# Altium project HOLYIOT NRF54H20.PrjPcb
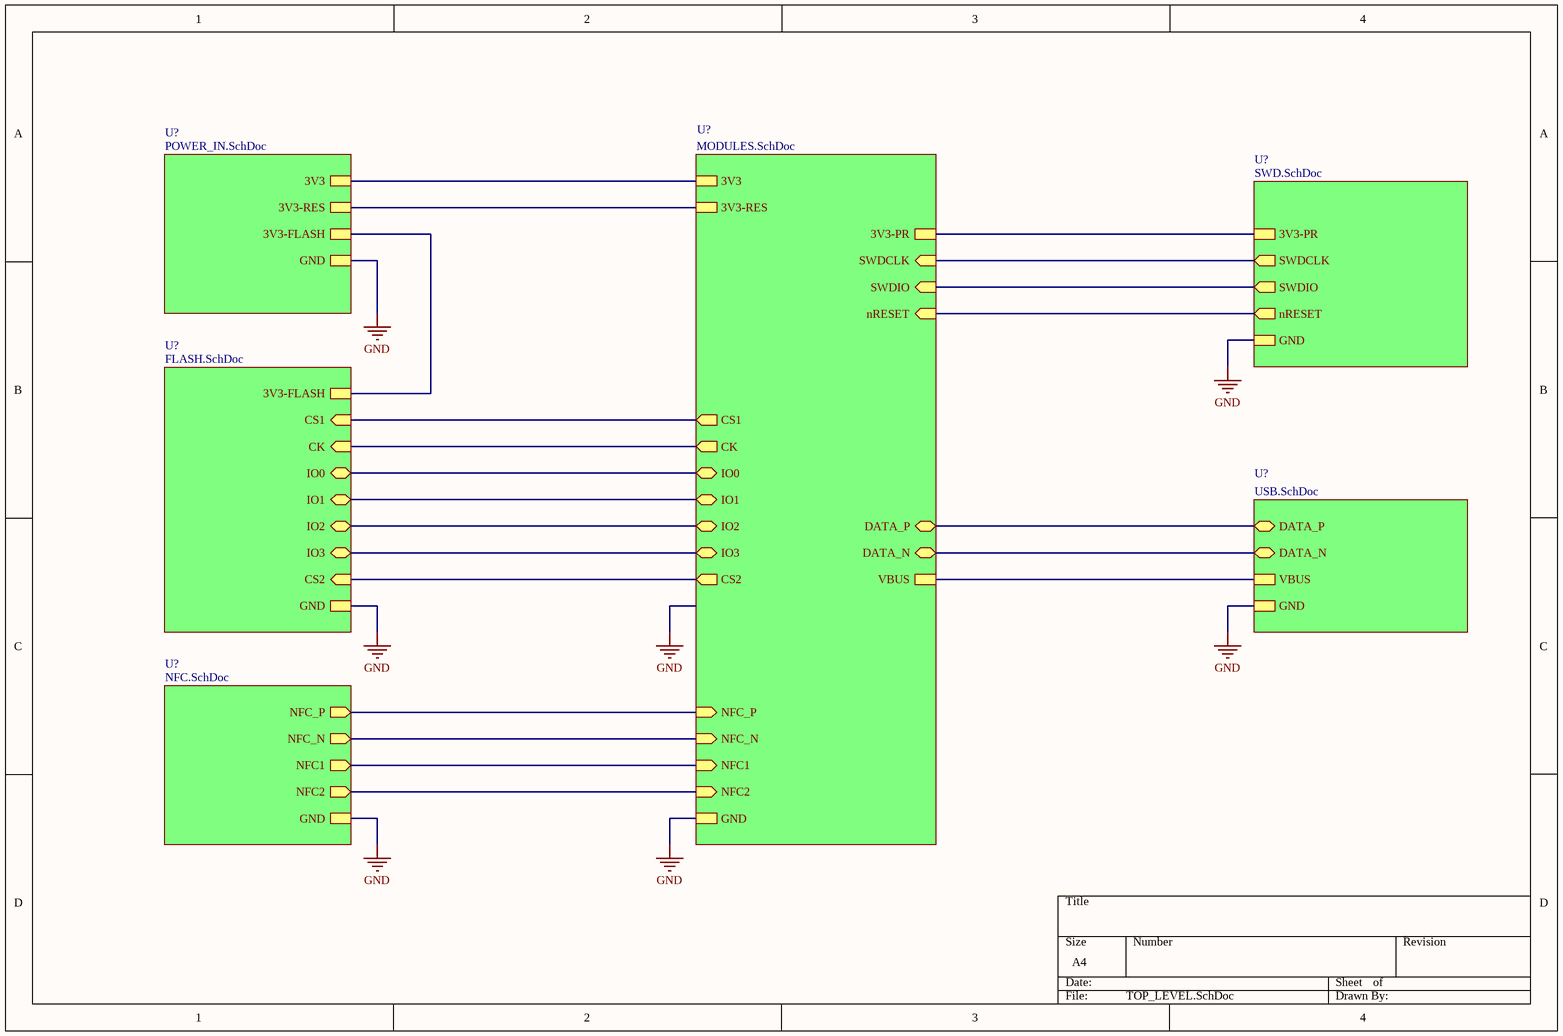
[diagram p0: TOP_LEVEL.SchDoc]
7 sheets, 101 parts. Net scope: strictly hierarchical (ports join the sheet entries above them; power ports are local).
Board file: PCB1.PcbDoc
Sheets:
  TOP_LEVEL.SchDoc
    U? = POWER_IN.SchDoc
    U? = MODULES.SchDoc
    U? = SWD.SchDoc
    U? = FLASH.SchDoc
    U? = USB.SchDoc
    U? = NFC.SchDoc

## Sheet TOP_LEVEL.SchDoc
size A4; SheetNumber: 1; SheetTotal: 7

### Sub-sheets
U? = POWER_IN.SchDoc: GND, 3V3, 3V3-RES, 3V3-FLASH
U? = MODULES.SchDoc: SWDCLK (in), SWDIO (in), nRESET (in), CS1 (out), CK (out), IO0 (bidir), IO1 (bidir), IO2 (bidir), NFC1 (in), NFC2 (in), NFC_N (in), NFC_P (in), GND, 3V3, 3V3-RES, 3V3-PR, VBUS, DATA_P (bidir), DATA_N (bidir), IO3 (bidir), CS2 (out)
U? = SWD.SchDoc: SWDCLK (out), SWDIO (out), nRESET (out), GND, 3V3-PR
U? = FLASH.SchDoc: CS1 (in), CK (in), IO0 (bidir), IO1 (bidir), IO2 (bidir), GND, 3V3-FLASH, IO3 (bidir), CS2 (in)
U? = USB.SchDoc: GND, VBUS, DATA_P (bidir), DATA_N (bidir)
U? = NFC.SchDoc: NFC_P (out), NFC_N (out), NFC1 (out), NFC2 (out), GND

### Nets
GND: sheet U?/GND, sheet U?/GND, sheet U?/GND, sheet U?/GND, sheet U?/GND, sheet U?/GND
DATA_N: sheet U?/DATA_N, sheet U?/DATA_N
DATA_P: sheet U?/DATA_P, sheet U?/DATA_P
IO0_APS: sheet U?/IO0, sheet U?/IO0
IO1_APS: sheet U?/IO1, sheet U?/IO1
IO2_APS: sheet U?/IO2, sheet U?/IO2
IO3_APS: sheet U?/IO3, sheet U?/IO3
nRESET: sheet U?/nRESET, sheet U?/nRESET
SWDCLK: sheet U?/SWDCLK, sheet U?/SWDCLK
SWDIO: sheet U?/SWDIO, sheet U?/SWDIO
VDD_APS: sheet U?/3V3, sheet U?/3V3-RES, sheet U?/3V3-FLASH, sheet U?/3V3, sheet U?/3V3-RES, sheet U?/3V3-PR, sheet U?/3V3-PR, sheet U?/3V3-FLASH
NetC7_2: sheet U?/NFC1, sheet U?/NFC1
NetC8_1: sheet U?/NFC2, sheet U?/NFC2
NetC9_2: sheet U?/NFC_P, sheet U?/NFC_P
NetC10_1: sheet U?/NFC_N, sheet U?/NFC_N
NetH20_7: sheet U?/CS2, sheet U?/CS2
NetH20_15: sheet U?/CK, sheet U?/CK
NetH20_18: sheet U?/CS1, sheet U?/CS1
NetH20_77: sheet U?/VBUS, sheet U?/VBUS

## Sheet POWER_IN.SchDoc
size A4; SheetNumber: 2; SheetTotal: 7
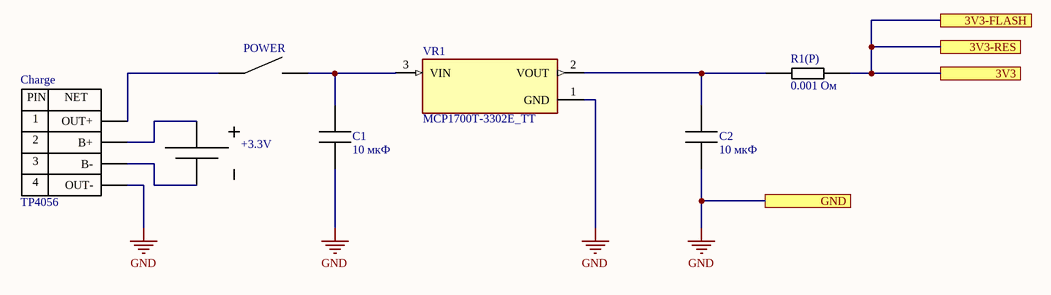
[diagram p1: POWER_IN.SchDoc]

### Parts
+3.3V  Battery  [Battery connect]  (value not drawn)
C1  10 мкФ  [Murata GRM21BR60J106K]
C2  10 мкФ  [Murata GRM21BR60J106K]
Charge  TP4056  [TP4056]
POWER  SMRS-101-1C2  [Button]  (value not drawn)
R1(P)  0.001 Ом  [Resistor 0.001]
VR1  MCP1700T-3302E_TT  [SOT95P237X112-3N]

### Ports
3V3 (see TOP_LEVEL[1A], MODULES[1C]), 3V3-FLASH (see TOP_LEVEL[1A], FLASH[3B]), 3V3-RES (see TOP_LEVEL[1A], MODULES[4A]), GND (see TOP_LEVEL[1A], FLASH[3C], MODULES[2D], NFC[2C], SWD[2B], USB[2C])

### Nets
GND: C1.1 C2.1 Charge.4(OUT-) VR1.1(GND) ; port GND
VDD_APS: R1(P).2 ; port 3V3, port 3V3-RES, port 3V3-FLASH
Net+3.3V_1: +3.3V.1 Charge.3(B-)
Net+3.3V_2: +3.3V.2 Charge.2(B+)
NetC1_2: C1.2 POWER.2 VR1.3(VIN)
NetC2_2: C2.2 R1(P).1 VR1.2(VOUT)
NetCharge_1: Charge.1(OUT+) POWER.1

### Notes on the sheet
- (in symbol TP4056) PIN; NET

### Library data of the parts
C1 C2 = Murata GRM21BR60J106K
POWER = Button
R1(P) = YAGEO PA2512FKF7W0R001E
VR1 = MCP1700T-3302E_TT: Pwr Sply Func,Voltage Regulator,LDO,SOT-23,PD 369.6mW,VO 3.3V,Regline +/-0.75%/V | Microchip Technology Inc. MCP1700T-3302E/TT; SnapEDA_Link: https://www.snapeda.com/parts/MCP1700T-3302E/TT/Microchip/view-part/?ref=snap; Package: SOT-23 Microchip; Value: *; MF: Microchip; MP: MCP1700T-3302E/TT; Check_prices: https://www.snapeda.com/parts/MCP1700T-3302E/TT/Microchip/view-part/?ref=eda

## Sheet MODULES.SchDoc
size A4; SheetNumber: 3; SheetTotal: 7
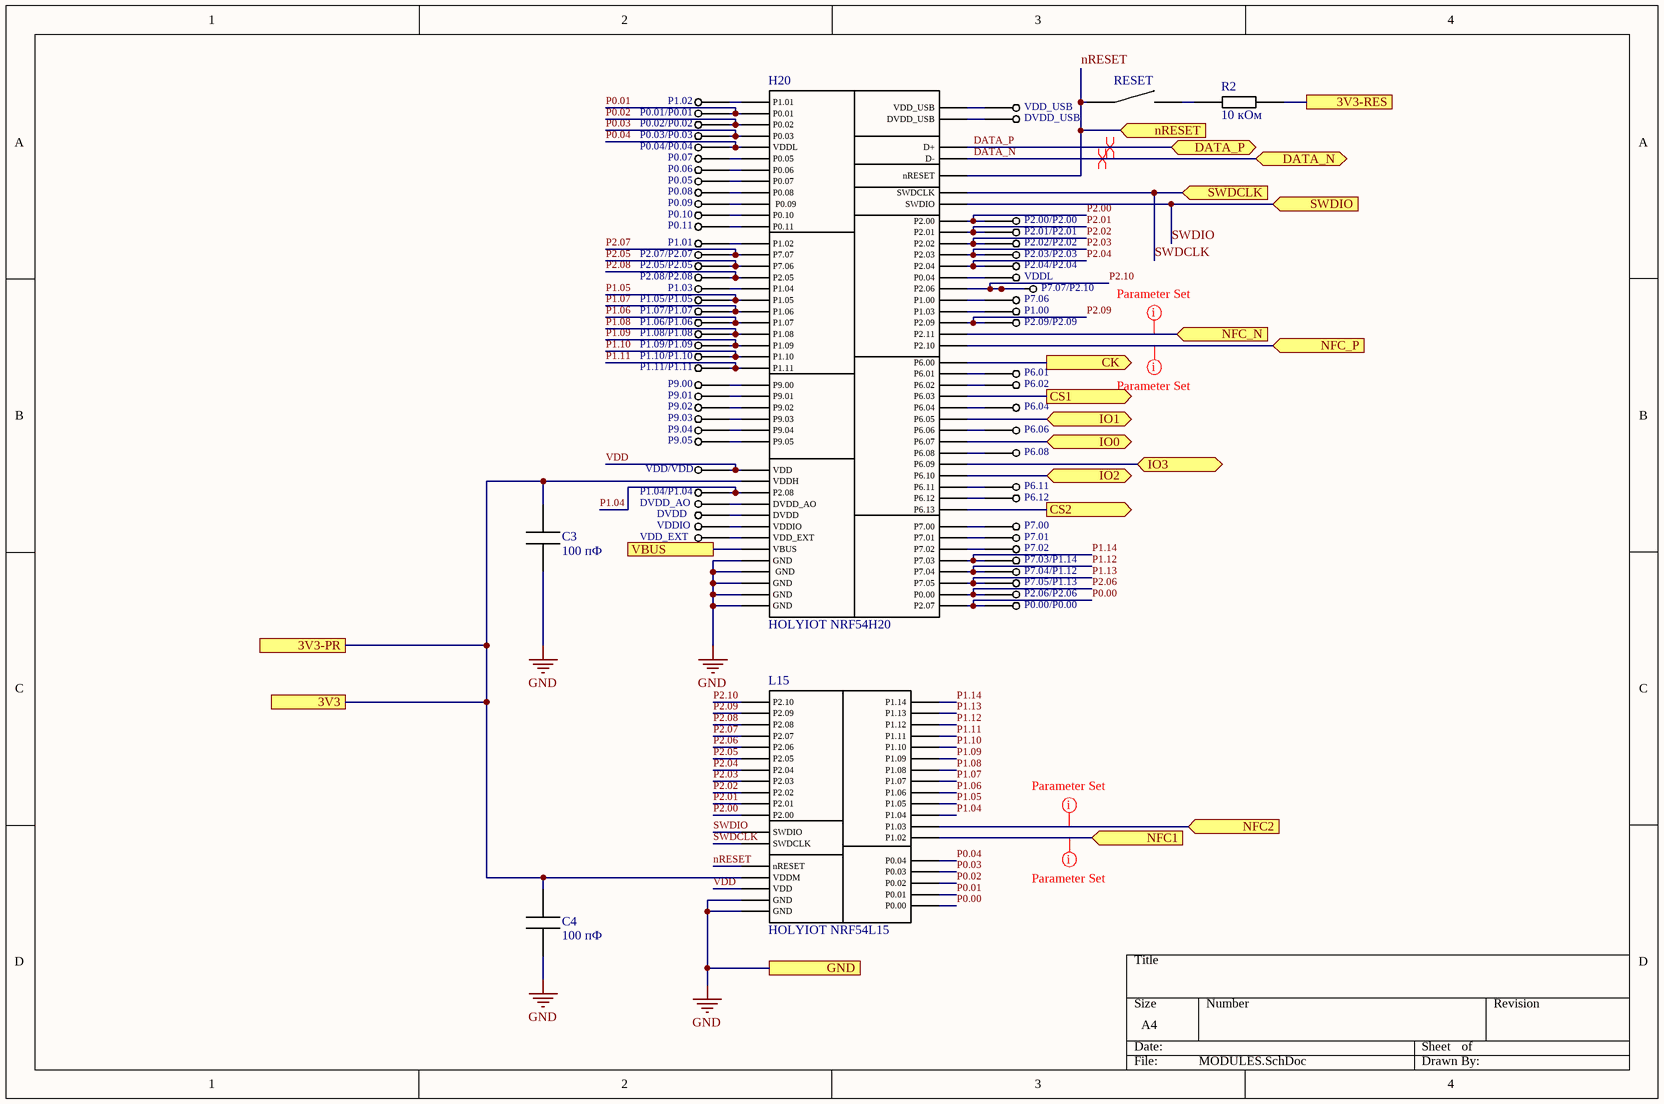
[diagram p2: MODULES.SchDoc]

### Parts
C3  100 пФ  [Murata GRM2165C1H101J]
C4  100 пФ  [Murata GRM2165C1H101J]
DVDD  PLS-1 (Ningbo Xinlaiya)  [PLS-1]  (value not drawn)
DVDD_AO  PLS-1 (Ningbo Xinlaiya)  [PLS-1]  (value not drawn)
DVDD_USB  PLS-1 (Ningbo Xinlaiya)  [PLS-1]  (value not drawn)
H20  HOLYIOT NRF54H20  [HOLYIOT NRF54H20]
L15  HOLYIOT NRF54L15  [HOLYIOT NRF54L15]
P0.00/P0.00  PLS-1 (Ningbo Xinlaiya)  [PLS-1]  (value not drawn)
P0.01/P0.01  PLS-1 (Ningbo Xinlaiya)  [PLS-1]  (value not drawn)
P0.02/P0.02  PLS-1 (Ningbo Xinlaiya)  [PLS-1]  (value not drawn)
P0.03/P0.03  PLS-1 (Ningbo Xinlaiya)  [PLS-1]  (value not drawn)
P0.04/P0.04  PLS-1 (Ningbo Xinlaiya)  [PLS-1]  (value not drawn)
P0.05  PLS-1 (Ningbo Xinlaiya)  [PLS-1]  (value not drawn)
P0.06  PLS-1 (Ningbo Xinlaiya)  [PLS-1]  (value not drawn)
P0.07  PLS-1 (Ningbo Xinlaiya)  [PLS-1]  (value not drawn)
P0.08  PLS-1 (Ningbo Xinlaiya)  [PLS-1]  (value not drawn)
P0.09  PLS-1 (Ningbo Xinlaiya)  [PLS-1]  (value not drawn)
P0.10  PLS-1 (Ningbo Xinlaiya)  [PLS-1]  (value not drawn)
P0.11  PLS-1 (Ningbo Xinlaiya)  [PLS-1]  (value not drawn)
P1.00  PLS-1 (Ningbo Xinlaiya)  [PLS-1]  (value not drawn)
P1.01  PLS-1 (Ningbo Xinlaiya)  [PLS-1]  (value not drawn)
P1.02  PLS-1 (Ningbo Xinlaiya)  [PLS-1]  (value not drawn)
P1.03  PLS-1 (Ningbo Xinlaiya)  [PLS-1]  (value not drawn)
P1.04/P1.04  PLS-1 (Ningbo Xinlaiya)  [PLS-1]  (value not drawn)
P1.05/P1.05  PLS-1 (Ningbo Xinlaiya)  [PLS-1]  (value not drawn)
P1.06/P1.06  PLS-1 (Ningbo Xinlaiya)  [PLS-1]  (value not drawn)
P1.07/P1.07  PLS-1 (Ningbo Xinlaiya)  [PLS-1]  (value not drawn)
P1.08/P1.08  PLS-1 (Ningbo Xinlaiya)  [PLS-1]  (value not drawn)
P1.09/P1.09  PLS-1 (Ningbo Xinlaiya)  [PLS-1]  (value not drawn)
P1.10/P1.10  PLS-1 (Ningbo Xinlaiya)  [PLS-1]  (value not drawn)
P1.11/P1.11  PLS-1 (Ningbo Xinlaiya)  [PLS-1]  (value not drawn)
P2.00/P2.00  PLS-1 (Ningbo Xinlaiya)  [PLS-1]  (value not drawn)
P2.01/P2.01  PLS-1 (Ningbo Xinlaiya)  [PLS-1]  (value not drawn)
P2.02/P2.02  PLS-1 (Ningbo Xinlaiya)  [PLS-1]  (value not drawn)
P2.03/P2.03  PLS-1 (Ningbo Xinlaiya)  [PLS-1]  (value not drawn)
P2.04/P2.04  PLS-1 (Ningbo Xinlaiya)  [PLS-1]  (value not drawn)
P2.05/P2.05  PLS-1 (Ningbo Xinlaiya)  [PLS-1]  (value not drawn)
P2.06/P2.06  PLS-1 (Ningbo Xinlaiya)  [PLS-1]  (value not drawn)
P2.07/P2.07  PLS-1 (Ningbo Xinlaiya)  [PLS-1]  (value not drawn)
P2.08/P2.08  PLS-1 (Ningbo Xinlaiya)  [PLS-1]  (value not drawn)
P2.09/P2.09  PLS-1 (Ningbo Xinlaiya)  [PLS-1]  (value not drawn)
P6.01  PLS-1 (Ningbo Xinlaiya)  [PLS-1]  (value not drawn)
P6.02  PLS-1 (Ningbo Xinlaiya)  [PLS-1]  (value not drawn)
P6.04  PLS-1 (Ningbo Xinlaiya)  [PLS-1]  (value not drawn)
P6.06  PLS-1 (Ningbo Xinlaiya)  [PLS-1]  (value not drawn)
P6.08  PLS-1 (Ningbo Xinlaiya)  [PLS-1]  (value not drawn)
P6.11  PLS-1 (Ningbo Xinlaiya)  [PLS-1]  (value not drawn)
P6.12  PLS-1 (Ningbo Xinlaiya)  [PLS-1]  (value not drawn)
P7.00  PLS-1 (Ningbo Xinlaiya)  [PLS-1]  (value not drawn)
P7.01  PLS-1 (Ningbo Xinlaiya)  [PLS-1]  (value not drawn)
P7.02  PLS-1 (Ningbo Xinlaiya)  [PLS-1]  (value not drawn)
P7.03/P1.14  PLS-1 (Ningbo Xinlaiya)  [PLS-1]  (value not drawn)
P7.04/P1.12  PLS-1 (Ningbo Xinlaiya)  [PLS-1]  (value not drawn)
P7.05/P1.13  PLS-1 (Ningbo Xinlaiya)  [PLS-1]  (value not drawn)
P7.06  PLS-1 (Ningbo Xinlaiya)  [PLS-1]  (value not drawn)
P7.07/P2.10  PLS-1 (Ningbo Xinlaiya)  [PLS-1]  (value not drawn)
P9.00  PLS-1 (Ningbo Xinlaiya)  [PLS-1]  (value not drawn)
P9.01  PLS-1 (Ningbo Xinlaiya)  [PLS-1]  (value not drawn)
P9.02  PLS-1 (Ningbo Xinlaiya)  [PLS-1]  (value not drawn)
P9.03  PLS-1 (Ningbo Xinlaiya)  [PLS-1]  (value not drawn)
P9.04  PLS-1 (Ningbo Xinlaiya)  [PLS-1]  (value not drawn)
P9.05  PLS-1 (Ningbo Xinlaiya)  [PLS-1]  (value not drawn)
R2  10 кОм  [Yageo RC0805JR-0710KL]
RESET  RES BUT  [RES BUT]  (value not drawn)
VDD/VDD  PLS-1 (Ningbo Xinlaiya)  [PLS-1]  (value not drawn)
VDD_EXT  PLS-1 (Ningbo Xinlaiya)  [PLS-1]  (value not drawn)
VDD_USB  PLS-1 (Ningbo Xinlaiya)  [PLS-1]  (value not drawn)
VDDIO  PLS-1 (Ningbo Xinlaiya)  [PLS-1]  (value not drawn)
VDDL  PLS-1 (Ningbo Xinlaiya)  [PLS-1]  (value not drawn)

### Ports
3V3 (see TOP_LEVEL[2A], POWER_IN[3B]), 3V3-PR (see TOP_LEVEL[3A], SWD[2B]), 3V3-RES (see TOP_LEVEL[2A], POWER_IN[3B]), CK (out, see TOP_LEVEL[2B], FLASH[1B]), CS1 (out, see TOP_LEVEL[2B], FLASH[1B]), CS2 (out, see TOP_LEVEL[2C], FLASH[2C]), DATA_N (bidir, see TOP_LEVEL[3C], USB[2B]), DATA_P (bidir, see TOP_LEVEL[3C], USB[2B]), GND (see TOP_LEVEL[2D], FLASH[3C], NFC[2C], POWER_IN[3C], SWD[2B], USB[2C]), IO0 (bidir, see TOP_LEVEL[2B], FLASH[1B]), IO1 (bidir, see TOP_LEVEL[2B], FLASH[1B]), IO2 (bidir, see TOP_LEVEL[2C], FLASH[1C]), IO3 (bidir, see TOP_LEVEL[2C], FLASH[1C]), NFC1 (in, see TOP_LEVEL[2C], NFC[1B]), NFC2 (in, see TOP_LEVEL[2D], NFC[1C]), NFC_N (in, see TOP_LEVEL[2C], NFC[1A]), NFC_P (in, see TOP_LEVEL[2C], NFC[1A]), nRESET (in, see TOP_LEVEL[3B], SWD[2B]), SWDCLK (in, see TOP_LEVEL[3A], SWD[2B]), SWDIO (in, see TOP_LEVEL[3B], SWD[2B]), VBUS (see TOP_LEVEL[3C], USB[2B])

### Nets
GND: C3.1 C4.1 H20.1(GND) H20.4(GND) H20.28(GND) H20.29(GND) H20.58(GND) L15.1(GND) L15.36(GND) ; port GND
DATA_N: H20.78(D-) ; port DATA_N
DATA_P: H20.79(D+) ; port DATA_P
IO0_APS: H20.13(P6.07) ; port IO0
IO1_APS: H20.20(P6.05) ; port IO1
IO2_APS: H20.10(P6.10) ; port IO2
IO3_APS: H20.11(P6.09) ; port IO3
nRESET: H20.72(nRESET) L15.35(nRESET) RESET.1 ; port nRESET
P0.00: H20.32(P2.07) L15.28(P0.00) P0.00/P0.00.1
P0.01: H20.68(P0.01) L15.29(P0.01) P0.01/P0.01.1
P0.02: H20.67(P0.02) L15.32(P0.02) P0.02/P0.02.1
P0.03: H20.66(P0.03) L15.33(P0.03) P0.03/P0.03.1
P0.04: H20.55(VDDL) L15.34(P0.04) P0.04/P0.04.1
P1.04: H20.31(P2.08) L15.12(P1.04) P1.04/P1.04.1
P1.05: H20.84(P1.05) L15.13(P1.05) P1.05/P1.05.1
P1.06: H20.60(P1.07) L15.14(P1.06) P1.06/P1.06.1
P1.07: H20.59(P1.06) L15.15(P1.07) P1.07/P1.07.1
P1.08: H20.83(P1.08) L15.16(P1.08) P1.08/P1.08.1
P1.09: H20.61(P1.09) L15.2(P1.09) P1.09/P1.09.1
P1.10: H20.81(P1.10) L15.3(P1.10) P1.10/P1.10.1
P1.11: H20.82(P1.11) L15.5(P1.11) P1.11/P1.11.1
P1.12: H20.38(P7.04) L15.6(P1.12) P7.04/P1.12.1
P1.13: H20.37(P7.05) L15.7(P1.13) P7.05/P1.13.1
P1.14: H20.39(P7.03) L15.8(P1.14) P7.03/P1.14.1
P2.00: H20.21(P2.00) L15.17(P2.00) P2.00/P2.00.1
P2.01: H20.22(P2.01) L15.18(P2.01) P2.01/P2.01.1
P2.02: H20.23(P2.02) L15.19(P2.02) P2.02/P2.02.1
P2.03: H20.24(P2.03) L15.20(P2.03) P2.03/P2.03.1
P2.04: H20.25(P2.04) L15.21(P2.04) P2.04/P2.04.1
P2.05: H20.36(P7.06) L15.22(P2.05) P2.05/P2.05.1
P2.06: H20.50(P0.00) L15.23(P2.06) P2.06/P2.06.1
P2.07: H20.35(P7.07) L15.24(P2.07) P2.07/P2.07.1
P2.08: H20.34(P2.05) L15.25(P2.08) P2.08/P2.08.1
P2.09: H20.30(P2.09) L15.26(P2.09) P2.09/P2.09.1
P2.10: H20.33(P2.06) L15.27(P2.10) P7.07/P2.10.1
SWDCLK: H20.74(SWDCLK) L15.30(SWDCLK) ; port SWDCLK
SWDIO: H20.73(SWDIO) L15.31(SWDIO) ; port SWDIO
VDD: H20.3(VDD) L15.4(VDD) VDD/VDD.1
VDD_APS: C3.2 C4.2 H20.2(VDDH) L15.9(VDDM) R2.2 ; port 3V3, port 3V3-PR, port 3V3-RES
NetC7_2: L15.10(P1.02) ; port NFC1
NetC8_1: L15.11(P1.03) ; port NFC2
NetC9_2: H20.27(P2.10) ; port NFC_P
NetC10_1: H20.26(P2.11) ; port NFC_N
NetDVDD_1: DVDD.1 H20.5(DVDD)
NetDVDD_AO_1: DVDD_AO.1 H20.6(DVDD_AO)
NetDVDD_USB_1: DVDD_USB.1 H20.76(DVDD_USB)
NetH20_7: H20.7(P6.13) ; port CS2
NetH20_8: H20.8(P6.12) P6.12.1
NetH20_9: H20.9(P6.11) P6.11.1
NetH20_12: H20.12(P6.08) P6.08.1
NetH20_14: H20.14(P6.06) P6.06.1
NetH20_15: H20.15(P6.00) ; port CK
NetH20_16: H20.16(P6.01) P6.01.1
NetH20_17: H20.17(P6.02) P6.02.1
NetH20_18: H20.18(P6.03) ; port CS1
NetH20_19: H20.19(P6.04) P6.04.1
NetH20_40: H20.40(P7.02) P7.02.1
NetH20_41: H20.41(P7.01) P7.01.1
NetH20_42: H20.42(P7.00) P7.00.1
NetH20_43: H20.43(P0.09) P0.09.1
NetH20_44: H20.44(P0.08) P0.08.1
NetH20_45: H20.45(P0.05) P0.07.1
NetH20_46: H20.46(P0.06) P0.06.1
NetH20_47: H20.47(P0.07) P0.05.1
NetH20_48: H20.48(P9.00) P9.00.1
NetH20_49: H20.49(P9.01) P9.01.1
NetH20_51: H20.51(P0.04) VDDL.1
NetH20_52: H20.52(P1.04) P1.03.1
NetH20_53: H20.53(P1.03) P1.00.1
NetH20_54: H20.54(P1.02) P1.01.1
NetH20_56: H20.56(P1.01) P1.02.1
NetH20_57: H20.57(P1.00) P7.06.1
NetH20_62: H20.62(P9.05) P9.05.1
NetH20_63: H20.63(P9.04) P9.04.1
NetH20_64: H20.64(P9.03) P9.03.1
NetH20_65: H20.65(P9.02) P9.02.1
NetH20_69: H20.69(P0.10) P0.10.1
NetH20_70: H20.70(P0.11) P0.11.1
NetH20_71: H20.71(VDDIO) VDDIO.1
NetH20_75: H20.75(VDD_EXT) VDD_EXT.1
NetH20_77: H20.77(VBUS) ; port VBUS
NetH20_80: H20.80(VDD_USB) VDD_USB.1
NetR2_1: R2.1 RESET.2

### Layout directives
differential pair; differential pair class USB: DATA_N, DATA_P
Parameter 1: 50 Ом: NetC7_2, NetC8_1, NetC9_2, NetC10_1

### Library data of the parts
C3 C4 = Murata GRM2165C1H101J
R2 = Yageo RC0805JR-0710KL

## Sheet SWD.SchDoc
size A4; SheetNumber: 4; SheetTotal: 7
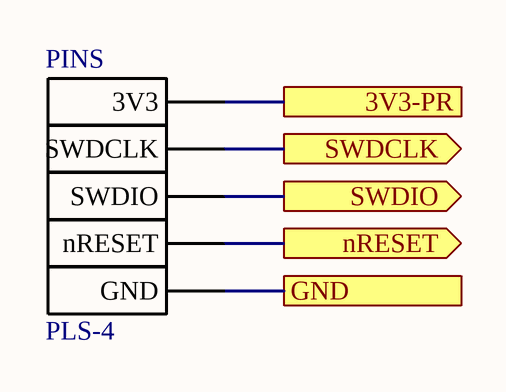
[diagram p3: SWD.SchDoc]

### Parts
PINS  PLS-4  [PLS-4 (DS-1021-1x4)]

### Ports
3V3-PR (see TOP_LEVEL[4A], MODULES[1C]), GND (see TOP_LEVEL[4B], FLASH[3C], MODULES[2D], NFC[2C], POWER_IN[3C], USB[3B]), nRESET (out, see TOP_LEVEL[4B], MODULES[3A]), SWDCLK (out, see TOP_LEVEL[4A], MODULES[3A]), SWDIO (out, see TOP_LEVEL[4B], MODULES[3A])

### Nets
GND: PINS.5(GND) ; port GND
nRESET: PINS.4(nRESET) ; port nRESET
SWDCLK: PINS.2(SWDCLK) ; port SWDCLK
SWDIO: PINS.3(SWDIO) ; port SWDIO
VDD_APS: PINS.1(3V3) ; port 3V3-PR

### Library data of the parts
PINS = PLS-4 (DS-1021-1x4)

## Sheet FLASH.SchDoc
size A4; SheetNumber: 5; SheetTotal: 7
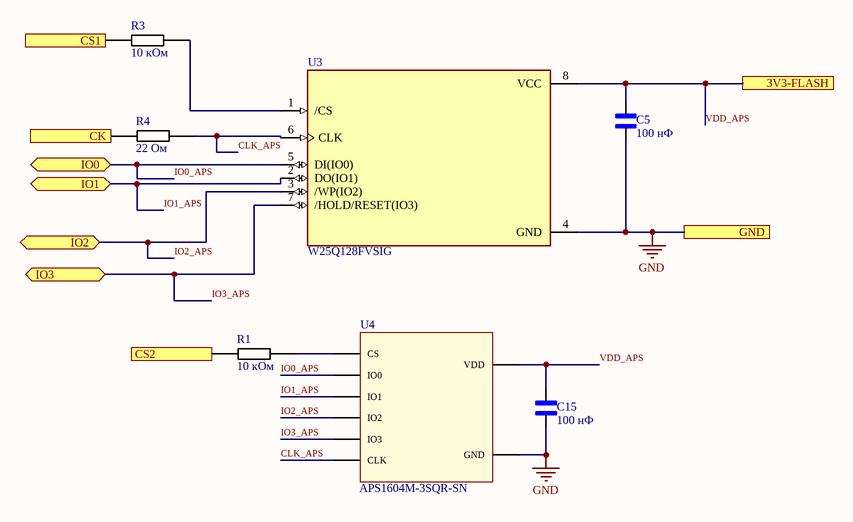
[diagram p4: FLASH.SchDoc]

### Parts
C5  100 нФ  [CAPC1005X22N]
C15  100 нФ  [CAPC1005X22N]
R1  10 кОм  [Yageo RC0805JR-0710KL]
R3  10 кОм  [Yageo RC0805JR-0710KL]
R4  22 Ом  [CR0805-JW-220ELF]
U3  W25Q128FVSIG  [SOIC127P790X216-8N]
U4  APS1604M-3SQR-SN  [APS1604M (SOP-8)]

### Ports
3V3-FLASH (see TOP_LEVEL[1B], POWER_IN[3B]), CK (in, see TOP_LEVEL[1B], MODULES[3B]), CS1 (in, see TOP_LEVEL[1B], MODULES[3B]), CS2 (in, see TOP_LEVEL[1C], MODULES[3B]), GND (see TOP_LEVEL[1C], MODULES[2D], NFC[2C], POWER_IN[3C], SWD[2B], USB[3B]), IO0 (bidir, see TOP_LEVEL[1B], MODULES[3B]), IO1 (bidir, see TOP_LEVEL[1B], MODULES[3B]), IO2 (bidir, see TOP_LEVEL[1C], MODULES[3B]), IO3 (bidir, see TOP_LEVEL[1C], MODULES[3B])

### Nets
GND: C5.1 C15.1 U3.4(GND) U4.4(GND) ; port GND
CLK_APS: R4.2 U3.6(CLK) U4.6(CLK)
IO0_APS: U3.5(DI(IO0)) U4.5(IO0) ; port IO0
IO1_APS: U3.2(DO(IO1)) U4.2(IO1) ; port IO1
IO2_APS: U3.3(/WP(IO2)) U4.3(IO2) ; port IO2
IO3_APS: U3.7(/HOLD/RESET(IO3)) U4.7(IO3) ; port IO3
VDD_APS: C5.2 C15.2 U3.8(VCC) U4.8(VDD) ; port 3V3-FLASH
NetH20_7: R1.1 ; port CS2
NetH20_15: R4.1 ; port CK
NetH20_18: R3.1 ; port CS1
NetR1_2: R1.2 U4.1(CS)
NetR3_2: R3.2 U3.1(/CS)

### Library data of the parts
C5 C15 = GRM152R60J104KE19D: SMD Capacitor X5R(EIA) with Capacitance: 0.10uF Tol. 10%. Rated Voltage: 6.3Vdc; MF: Murata; SnapEDA_Link: https://www.snapeda.com/parts/GRM152R60J104KE19D/Murata/view-part/?ref=snap; Package: 1005 Murata; Value: *; MP: GRM152R60J104KE19D; Check_prices: https://www.snapeda.com/parts/GRM152R60J104KE19D/Murata/view-part/?ref=eda
R1 R3 = Yageo RC0805JR-0710KL
R4 = CR0805-JW-220ELF
U3 = W25Q128JVSIQ: FLASH - NOR Memory IC 128Mb (16M x 8) SPI - Quad I/O, QPI, DTR 133 MHz 8-SOIC; MF: Winbond Electronics; SnapEDA_Link: https://www.snapeda.com/parts/W25Q128JVSIQ/Winbond/view-part/?ref=snap; Package: SOIC-8 Winbond Electronics; Value: *; MP: W25Q128JVSIQ; Check_prices: https://www.snapeda.com/parts/W25Q128JVSIQ/Winbond/view-part/?ref=eda
U4 = APS1604M

## Sheet USB.SchDoc
size A4; SheetNumber: 6; SheetTotal: 7
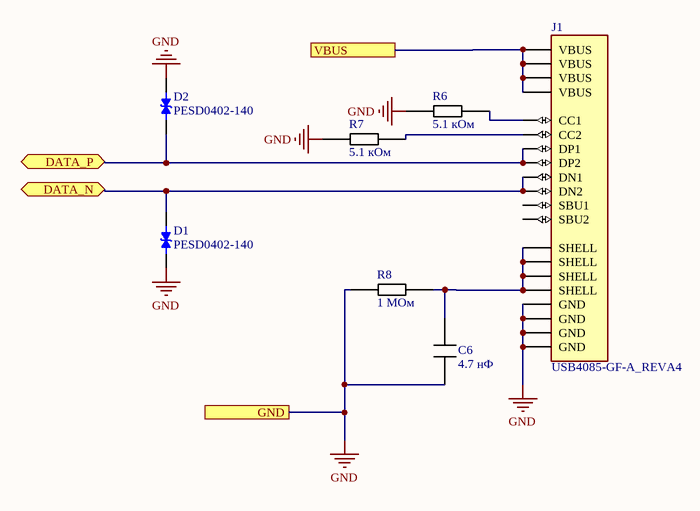
[diagram p5: USB.SchDoc]

### Parts
C6  4.7 нФ  [WURTH 885012206012]
D1  PESD0402-140  [DIO_PESD0402-140]
D2  PESD0402-140  [DIO_PESD0402-140]
J1  USB4085-GF-A_REVA4  [GCT_USB4085-GF-A_REVA4]
R6  5.1 кОм  [RC0805FR-075K1L]
R7  5.1 кОм  [RC0805FR-075K1L]
R8  1 МОм  [RC0805FR-071ML]

### Ports
DATA_N (bidir, see TOP_LEVEL[4C], MODULES[4A]), DATA_P (bidir, see TOP_LEVEL[4C], MODULES[3A]), GND (see TOP_LEVEL[4C], FLASH[3C], MODULES[2D], NFC[2C], POWER_IN[3C], SWD[2B]), VBUS (see TOP_LEVEL[4C], MODULES[2B])

### Nets
GND: C6.1 D1.2 D2.2 J1.A1(GND) J1.A12(GND) J1.B1(GND) J1.B12(GND) R6.1 R7.2 R8.1 ; port GND
DATA_N: D1.1 J1.A7(DN1) J1.B7(DN2) ; port DATA_N
DATA_P: D2.1 J1.A6(DP1) J1.B6(DP2) ; port DATA_P
NetC6_2: C6.2 J1.S1(SHELL) J1.S2(SHELL) J1.S3(SHELL) J1.S4(SHELL) R8.2
NetH20_77: J1.A4(VBUS) J1.A9(VBUS) J1.B4(VBUS) J1.B9(VBUS) ; port VBUS
NetJ1_A5: J1.A5(CC1) R6.2
NetJ1_B5: J1.B5(CC2) R7.1

Not connected (* = marked no-connect by the designer): J1 A8(SBU1) B8(SBU2)

### Library data of the parts
C6 = WURTH 885012206012
D1 D2 = PESD0402-140: 40V Clamp - Ipp Tvs Diode Surface Mount 0402; MF: Littelfuse Inc.; SnapEDA_Link: https://www.snapeda.com/parts/PESD0402-140/Littelfuse/view-part/?ref=snap; Package: 0402 Littelfuse Inc.; Value: *; MP: PESD0402-140; Check_prices: https://www.snapeda.com/parts/PESD0402-140/Littelfuse/view-part/?ref=eda
J1 = USB4085-GF-A_REVA4: USB-C (USB TYPE-C) USB 2.0 Receptacle Connector 24 (16+8 Dummy) Position Through Hole, Right Angle, low cost, 3.46mm profile, 16 pin, horizontal, Top mount; MF: Global Connector Technology; SnapEDA_Link: https://www.snapeda.com/parts/USB4085-GF-A/Global+Connector+Technology/view-part/?ref=snap; Package: None; MP: USB4085-GF-A; Check_prices: https://www.snapeda.com/parts/USB4085-GF-A/Global+Connector+Technology/view-part/?ref=eda; Purchase-URL: https://pricing.snapeda.com/search/part/USB4085-GF-A/?ref=eda; Price: None; Value: *; Availability: In Stock
R6 R7 = RC0805FR-075K1L
R8 = RC0805FR-071ML

## Sheet NFC.SchDoc
size A4; SheetNumber: 7; SheetTotal: 7
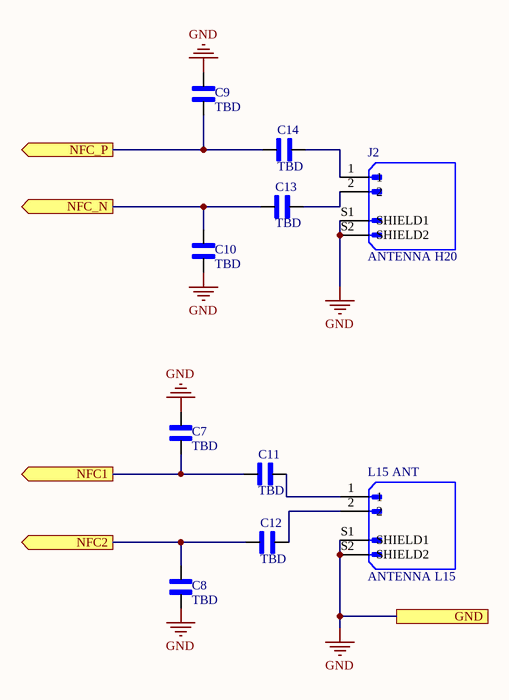
[diagram p6: NFC.SchDoc]

### Parts
C7  TBD  [CAPC2012X88N]
C8  TBD  [CAPC2012X88N]
C9  TBD  [CAPC2012X88N]
C10  TBD  [CAPC2012X88N]
C11  TBD  [CAPC2012X88N]
C12  TBD  [CAPC2012X88N]
C13  TBD  [CAPC2012X88N]
C14  TBD  [CAPC2012X88N]
J2  ANTENNA H20  [MOLEX_532610271]
L15_ANT  ANTENNA L15  [MOLEX_532610271]

### Ports
GND (see TOP_LEVEL[1D], FLASH[3C], MODULES[2D], POWER_IN[3C], SWD[2B], USB[2C]), NFC1 (out, see TOP_LEVEL[1C], MODULES[3D]), NFC2 (out, see TOP_LEVEL[1D], MODULES[3D]), NFC_N (out, see TOP_LEVEL[1C], MODULES[3B]), NFC_P (out, see TOP_LEVEL[1C], MODULES[4B])

### Nets
GND: C7.1 C8.2 C9.1 C10.2 J2.S1(SHIELD1) J2.S2(SHIELD2) L15_ANT.S1(SHIELD1) L15_ANT.S2(SHIELD2) ; port GND
NetC7_2: C7.2 C11.2 ; port NFC1
NetC8_1: C8.1 C12.2 ; port NFC2
NetC9_2: C9.2 C14.2 ; port NFC_P
NetC10_1: C10.1 C13.2 ; port NFC_N
NetC11_1: C11.1 L15_ANT.1
NetC12_1: C12.1 L15_ANT.2
NetC13_1: C13.1 J2.2
NetC14_1: C14.1 J2.1

### Library data of the parts
C7-C14 = C0805C473K1RACTU: 0805 C0G/NP0 ceramic capacitor for nfc fix; MF: KEMET; SnapEDA_Link: https://www.snapeda.com/parts/C0805C473K1RACTU/KEMET/view-part/?ref=snap; Package: 805-2 KEMET; Value: *; MP: C0805C473K1RACTU; Check_prices: https://www.snapeda.com/parts/C0805C473K1RACTU/KEMET/view-part/?ref=eda
J2 L15_ANT = 532610271: Connector Header Surface Mount, Right Angle 2 position 0.049 (1.25mm); MF: Molex; Purchase-URL: https://pricing.snapeda.com/search/part/532610271/?ref=eda; Value: *; MP: 532610271; Package: None; Check_prices: https://www.snapeda.com/parts/532610271/Molex/view-part/?ref=eda; Price: None; Availability: In Stock; SnapEDA_Link: https://www.snapeda.com/parts/532610271/Molex/view-part/?ref=snap

## Nets that join several sheets
GND: POWER_IN (C1.1 C2.1 Charge.4 VR1.1), MODULES (9 pins), SWD (PINS.5), FLASH (C5.1 C15.1 U3.4 U4.4), USB (10 pins), NFC (8 pins)
DATA_N: MODULES (H20.78), USB (D1.1 J1.A7 J1.B7)
DATA_P: MODULES (H20.79), USB (D2.1 J1.A6 J1.B6)
IO0_APS: MODULES (H20.13), FLASH (U3.5 U4.5)
IO1_APS: MODULES (H20.20), FLASH (U3.2 U4.2)
IO2_APS: MODULES (H20.10), FLASH (U3.3 U4.3)
IO3_APS: MODULES (H20.11), FLASH (U3.7 U4.7)
NetC7_2: MODULES (L15.10), NFC (C7.2 C11.2)
NetC8_1: MODULES (L15.11), NFC (C8.1 C12.2)
NetC9_2: MODULES (H20.27), NFC (C9.2 C14.2)
NetC10_1: MODULES (H20.26), NFC (C10.1 C13.2)
NetH20_7: MODULES (H20.7), FLASH (R1.1)
NetH20_15: MODULES (H20.15), FLASH (R4.1)
NetH20_18: MODULES (H20.18), FLASH (R3.1)
NetH20_77: MODULES (H20.77), USB (J1.A4 J1.A9 J1.B4 J1.B9)
nRESET: MODULES (H20.72 L15.35 RESET.1), SWD (PINS.4)
SWDCLK: MODULES (H20.74 L15.30), SWD (PINS.2)
SWDIO: MODULES (H20.73 L15.31), SWD (PINS.3)
VDD_APS: POWER_IN (R1(P).2), MODULES (5 pins), SWD (PINS.1), FLASH (C5.2 C15.2 U3.8 U4.8)